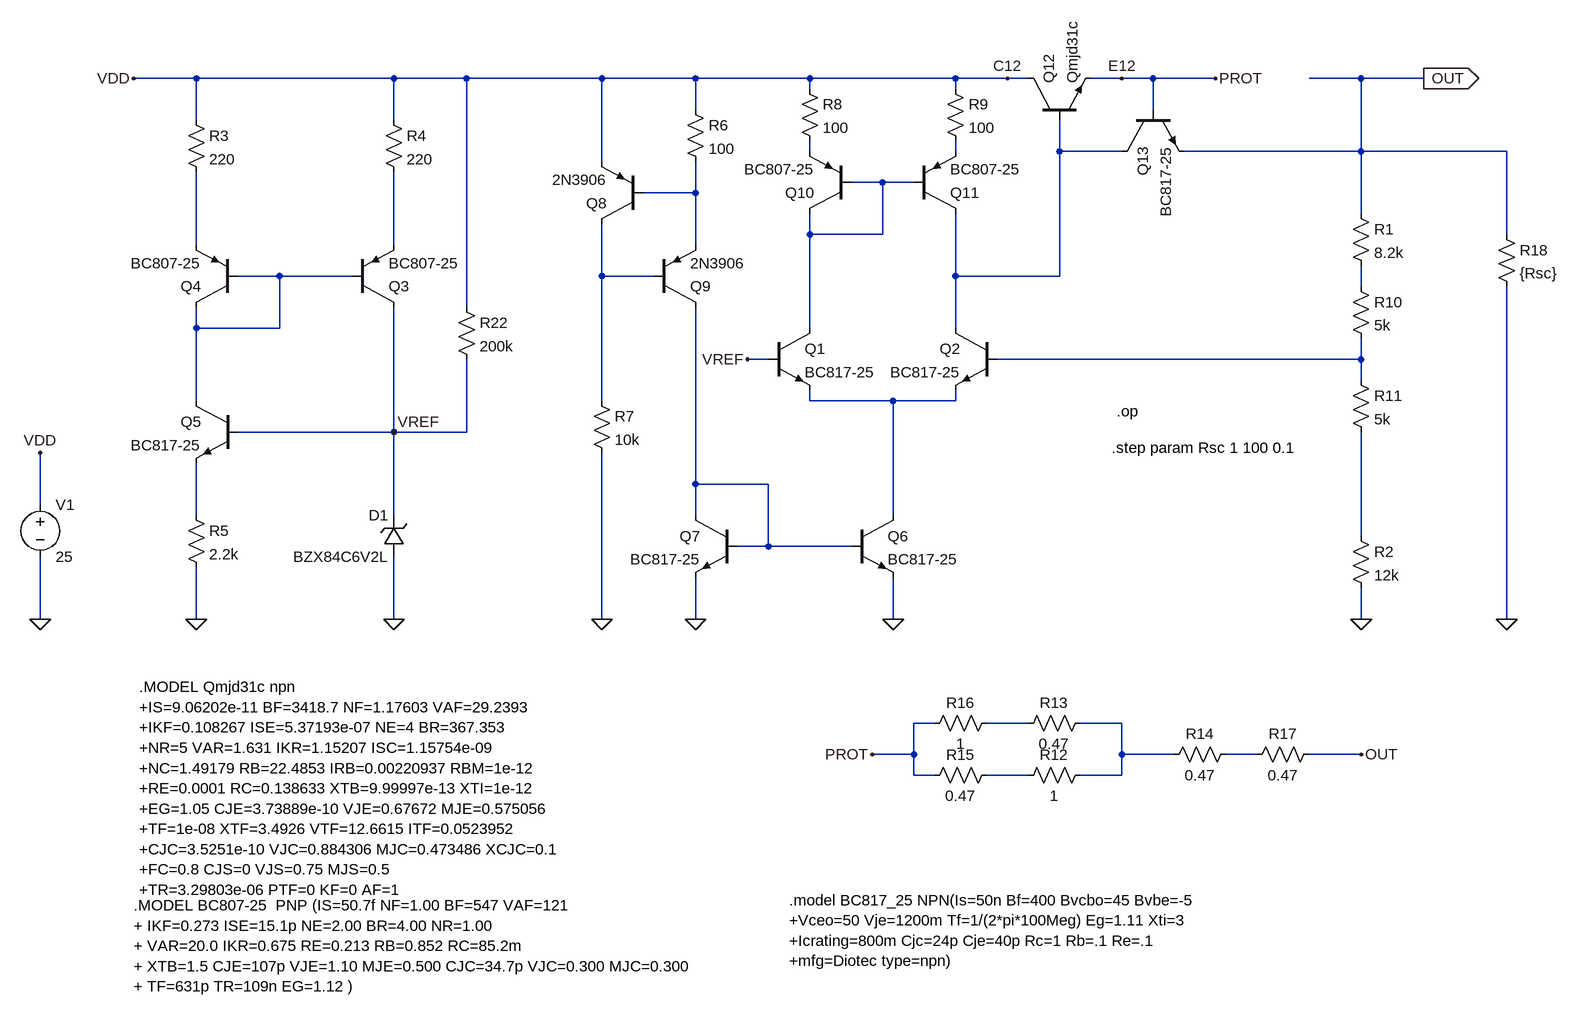
[diagram p0: schematic SC_FAILURE.asc]
SC_FAILURE.asc, the LTspice schematic file:
Version 4
SHEET 1 2212 680
WIRE -1040 -720 -1136 -720
WIRE -736 -720 -1040 -720
WIRE -624 -720 -736 -720
WIRE -416 -720 -624 -720
WIRE -272 -720 -416 -720
WIRE -96 -720 -272 -720
WIRE 128 -720 -96 -720
WIRE 208 -720 128 -720
WIRE 240 -720 208 -720
WIRE 384 -720 336 -720
WIRE 432 -720 384 -720
WIRE 528 -720 432 -720
WIRE 752 -720 672 -720
WIRE 848 -720 752 -720
WIRE -96 -704 -96 -720
WIRE 128 -704 128 -720
WIRE -272 -672 -272 -720
WIRE 432 -672 432 -720
WIRE -1040 -656 -1040 -720
WIRE -736 -656 -736 -720
WIRE -96 -608 -96 -624
WIRE 128 -608 128 -624
WIRE 288 -608 288 -656
WIRE 384 -608 288 -608
WIRE 752 -608 752 -720
WIRE 752 -608 480 -608
WIRE 976 -608 752 -608
WIRE -416 -592 -416 -720
WIRE 16 -560 -32 -560
WIRE 64 -560 16 -560
WIRE -272 -544 -272 -592
WIRE -272 -544 -352 -544
WIRE 752 -512 752 -608
WIRE -96 -480 -96 -512
WIRE 16 -480 16 -560
WIRE 16 -480 -96 -480
WIRE 976 -480 976 -608
WIRE -1040 -464 -1040 -576
WIRE -736 -464 -736 -576
WIRE -272 -464 -272 -544
WIRE -912 -416 -976 -416
WIRE -800 -416 -912 -416
WIRE -416 -416 -416 -496
WIRE -336 -416 -416 -416
WIRE 128 -416 128 -512
WIRE 288 -416 288 -608
WIRE 288 -416 128 -416
WIRE 752 -400 752 -432
WIRE -624 -368 -624 -720
WIRE -1040 -336 -1040 -368
WIRE -912 -336 -912 -416
WIRE -912 -336 -1040 -336
WIRE -96 -336 -96 -480
WIRE 128 -336 128 -416
WIRE -160 -288 -192 -288
WIRE 752 -288 752 -320
WIRE 752 -288 192 -288
WIRE 752 -256 752 -288
WIRE -1040 -224 -1040 -336
WIRE -416 -224 -416 -416
WIRE -96 -224 -96 -240
WIRE 32 -224 -96 -224
WIRE 128 -224 128 -240
WIRE 128 -224 32 -224
WIRE -736 -176 -736 -368
WIRE -736 -176 -976 -176
WIRE -624 -176 -624 -288
WIRE -624 -176 -736 -176
WIRE -272 -96 -272 -368
WIRE -160 -96 -272 -96
WIRE -1280 -64 -1280 -144
WIRE -1040 -48 -1040 -128
WIRE -736 -48 -736 -176
WIRE -272 -48 -272 -96
WIRE 32 -48 32 -224
WIRE 752 -16 752 -176
WIRE -160 0 -160 -96
WIRE -160 0 -208 0
WIRE -32 0 -160 0
WIRE -1280 112 -1280 16
WIRE -1040 112 -1040 32
WIRE -736 112 -736 16
WIRE -416 112 -416 -144
WIRE -272 112 -272 48
WIRE 32 112 32 48
WIRE 752 112 752 64
WIRE 976 112 976 -400
WIRE 96 272 64 272
WIRE 240 272 176 272
WIRE 384 272 320 272
WIRE 64 320 64 272
WIRE 64 320 0 320
WIRE 384 320 384 272
WIRE 464 320 384 320
WIRE 592 320 544 320
WIRE 752 320 672 320
WIRE 64 352 64 320
WIRE 96 352 64 352
WIRE 240 352 176 352
WIRE 384 352 384 320
WIRE 384 352 320 352
FLAG 752 112 0
FLAG -1040 112 0
FLAG 32 112 0
FLAG -272 112 0
FLAG -416 112 0
FLAG -192 -288 VREF
FLAG 848 -720 OUT
IOPIN 848 -720 Out
FLAG 208 -720 C12
FLAG 384 -720 E12
FLAG -1280 112 0
FLAG 528 -720 PROT
FLAG 0 320 PROT
FLAG 752 320 OUT
FLAG -1280 -144 VDD
FLAG -1136 -720 VDD
FLAG -736 112 0
FLAG -736 -176 VREF
FLAG 976 112 0
SYMBOL npn -160 -336 R0
SYMATTR InstName Q1
SYMATTR Value BC817-25
SYMBOL npn 192 -336 M0
SYMATTR InstName Q2
SYMATTR Value BC817-25
SYMBOL res 736 -528 R0
SYMATTR InstName R1
SYMATTR Value 8.2k
SYMBOL res 736 -32 R0
SYMATTR InstName R2
SYMATTR Value 12k
SYMBOL pnp -800 -368 M180
SYMATTR InstName Q3
SYMATTR Value BC807-25
SYMBOL pnp -976 -368 R180
SYMATTR InstName Q4
SYMATTR Value BC807-25
SYMBOL npn -976 -224 M0
SYMATTR InstName Q5
SYMATTR Value BC817-25
SYMBOL res -1056 -672 R0
SYMATTR InstName R3
SYMATTR Value 220
SYMBOL res -752 -672 R0
SYMATTR InstName R4
SYMATTR Value 220
SYMBOL res -1056 -64 R0
SYMATTR InstName R5
SYMATTR Value 2.2k
SYMBOL npn -32 -48 R0
SYMATTR InstName Q6
SYMATTR Value BC817-25
SYMBOL npn -208 -48 M0
SYMATTR InstName Q7
SYMATTR Value BC817-25
SYMBOL pnp -352 -496 R180
SYMATTR InstName Q8
SYMATTR Value 2N3906
SYMBOL pnp -336 -368 M180
SYMATTR InstName Q9
SYMATTR Value 2N3906
SYMBOL res -288 -688 R0
SYMATTR InstName R6
SYMATTR Value 100
SYMBOL res -432 -240 R0
SYMATTR InstName R7
SYMATTR Value 10k
SYMBOL pnp -32 -512 R180
SYMATTR InstName Q10
SYMATTR Value BC807-25
SYMBOL pnp 64 -512 M180
SYMATTR InstName Q11
SYMATTR Value BC807-25
SYMBOL npn 240 -656 R270
SYMATTR InstName Q12
SYMATTR Value Qmjd31c
SYMBOL res -112 -720 R0
SYMATTR InstName R8
SYMATTR Value 100
SYMBOL res 112 -720 R0
SYMATTR InstName R9
SYMATTR Value 100
SYMBOL npn 384 -672 M90
SYMATTR InstName Q13
SYMATTR Value BC817-25
SYMBOL res 736 -416 R0
SYMATTR InstName R10
SYMATTR Value 5k
SYMBOL res 736 -272 R0
SYMATTR InstName R11
SYMATTR Value 5k
SYMBOL res 336 336 R90
WINDOW 0 0 56 VBottom 2
WINDOW 3 32 56 VTop 2
SYMATTR InstName R12
SYMATTR Value 1
SYMBOL res 336 256 R90
WINDOW 0 0 56 VBottom 2
WINDOW 3 32 56 VTop 2
SYMATTR InstName R13
SYMATTR Value 0.47
SYMBOL res 560 304 R90
WINDOW 0 0 56 VBottom 2
WINDOW 3 32 56 VTop 2
SYMATTR InstName R14
SYMATTR Value 0.47
SYMBOL res 192 336 R90
WINDOW 0 0 56 VBottom 2
WINDOW 3 32 56 VTop 2
SYMATTR InstName R15
SYMATTR Value 0.47
SYMBOL res 192 256 R90
WINDOW 0 0 56 VBottom 2
WINDOW 3 32 56 VTop 2
SYMATTR InstName R16
SYMATTR Value 1
SYMBOL res 688 304 R90
WINDOW 0 0 56 VBottom 2
WINDOW 3 32 56 VTop 2
SYMATTR InstName R17
SYMATTR Value 0.47
SYMBOL zener -720 16 R180
WINDOW 0 24 64 Left 2
WINDOW 3 24 0 Left 2
SYMATTR InstName D1
SYMATTR Value BZX84C6V2L
SYMBOL voltage -1280 -80 R0
WINDOW 123 0 0 Left 0
WINDOW 39 0 0 Left 0
SYMATTR InstName V1
SYMATTR Value 25
SYMBOL res 960 -496 R0
SYMATTR InstName R18
SYMATTR Value {Rsc}
SYMBOL res -640 -384 R0
SYMATTR InstName R22
SYMATTR Value 200k
TEXT -128 544 Left 2 !.model BC817_25 NPN(Is=50n Bf=400 Bvcbo=45 Bvbe=-5\n+Vceo=50 Vje=1200m Tf=1/(2*pi*100Meg) Eg=1.11 Xti=3\n+Icrating=800m Cjc=24p Cje=40p Rc=1 Rb=.1 Re=.1\n+mfg=Diotec type=npn)
TEXT -1128 216 Left 2 !.MODEL Qmjd31c npn\n+IS=9.06202e-11 BF=3418.7 NF=1.17603 VAF=29.2393\n+IKF=0.108267 ISE=5.37193e-07 NE=4 BR=367.353\n+NR=5 VAR=1.631 IKR=1.15207 ISC=1.15754e-09\n+NC=1.49179 RB=22.4853 IRB=0.00220937 RBM=1e-12\n+RE=0.0001 RC=0.138633 XTB=9.99997e-13 XTI=1e-12\n+EG=1.05 CJE=3.73889e-10 VJE=0.67672 MJE=0.575056\n+TF=1e-08 XTF=3.4926 VTF=12.6615 ITF=0.0523952\n+CJC=3.5251e-10 VJC=0.884306 MJC=0.473486 XCJC=0.1\n+FC=0.8 CJS=0 VJS=0.75 MJS=0.5\n+TR=3.29803e-06 PTF=0 KF=0 AF=1
TEXT -1136 552 Left 2 !.MODEL BC807-25  PNP (IS=50.7f NF=1.00 BF=547 VAF=121\n+ IKF=0.273 ISE=15.1p NE=2.00 BR=4.00 NR=1.00\n+ VAR=20.0 IKR=0.675 RE=0.213 RB=0.852 RC=85.2m\n+ XTB=1.5 CJE=107p VJE=1.10 MJE=0.500 CJC=34.7p VJC=0.300 MJC=0.300 \n+ TF=631p TR=109n EG=1.12 )
TEXT 376 -208 Left 2 !.op
TEXT 368 -152 Left 2 !.step param Rsc 1 100 0.1

The netlist it stands for:
* SC_FAILURE.asc
Q1 N004 VREF N012 0 BC817-25
Q2 N003 N011 N012 0 BC817-25
R1 OUT N010 8.2k
R2 N015 0 12k
Q3 VREF N008 N007 0 BC807-25
Q4 N008 N008 N006 0 BC807-25
Q5 N008 VREF N014 0 BC817-25
R3 VDD N006 220
R4 VDD N007 220
R5 N014 0 2.2k
Q6 N012 N013 0 0 BC817-25
Q7 N013 N013 0 0 BC817-25
Q8 N009 N005 VDD 0 2N3906
Q9 N013 N009 N005 0 2N3906
R6 VDD N005 100
R7 N009 0 10k
Q10 N004 N004 N001 0 BC807-25
Q11 N003 N004 N002 0 BC807-25
Q12 VDD N003 PROT 0 Qmjd31c
R8 VDD N001 100
R9 VDD N002 100
Q13 N003 PROT OUT 0 BC817-25
R10 N010 N011 5k
R11 N011 N015 5k
R12 N017 N019 1
R13 N017 N016 0.47
R14 N018 N017 0.47
R15 N019 PROT 0.47
R16 N016 PROT 1
R17 OUT N018 0.47
D1 0 VREF BZX84C6V2L
V1 VDD 0 25
R18 OUT 0 {Rsc}
R22 VDD VREF 200k
.model D D
.lib standard.dio
.model NPN NPN
.model PNP PNP
.lib standard.bjt
.model BC817_25 NPN(Is=50n Bf=400 Bvcbo=45 Bvbe=-5
+Vceo=50 Vje=1200m Tf=1/(2*pi*100Meg) Eg=1.11 Xti=3
+Icrating=800m Cjc=24p Cje=40p Rc=1 Rb=.1 Re=.1
+mfg=Diotec type=npn)
.MODEL Qmjd31c npn
+IS=9.06202e-11 BF=3418.7 NF=1.17603 VAF=29.2393
+IKF=0.108267 ISE=5.37193e-07 NE=4 BR=367.353
+NR=5 VAR=1.631 IKR=1.15207 ISC=1.15754e-09
+NC=1.49179 RB=22.4853 IRB=0.00220937 RBM=1e-12
+RE=0.0001 RC=0.138633 XTB=9.99997e-13 XTI=1e-12
+EG=1.05 CJE=3.73889e-10 VJE=0.67672 MJE=0.575056
+TF=1e-08 XTF=3.4926 VTF=12.6615 ITF=0.0523952
+CJC=3.5251e-10 VJC=0.884306 MJC=0.473486 XCJC=0.1
+FC=0.8 CJS=0 VJS=0.75 MJS=0.5
+TR=3.29803e-06 PTF=0 KF=0 AF=1
.MODEL BC807-25  PNP (IS=50.7f NF=1.00 BF=547 VAF=121
+ IKF=0.273 ISE=15.1p NE=2.00 BR=4.00 NR=1.00
+ VAR=20.0 IKR=0.675 RE=0.213 RB=0.852 RC=85.2m
+ XTB=1.5 CJE=107p VJE=1.10 MJE=0.500 CJC=34.7p VJC=0.300 MJC=0.300
+ TF=631p TR=109n EG=1.12 )
.op
.step param Rsc 1 100 0.1
.backanno
.end